# Altium schematic sheet ftdi.SchDoc
size A4
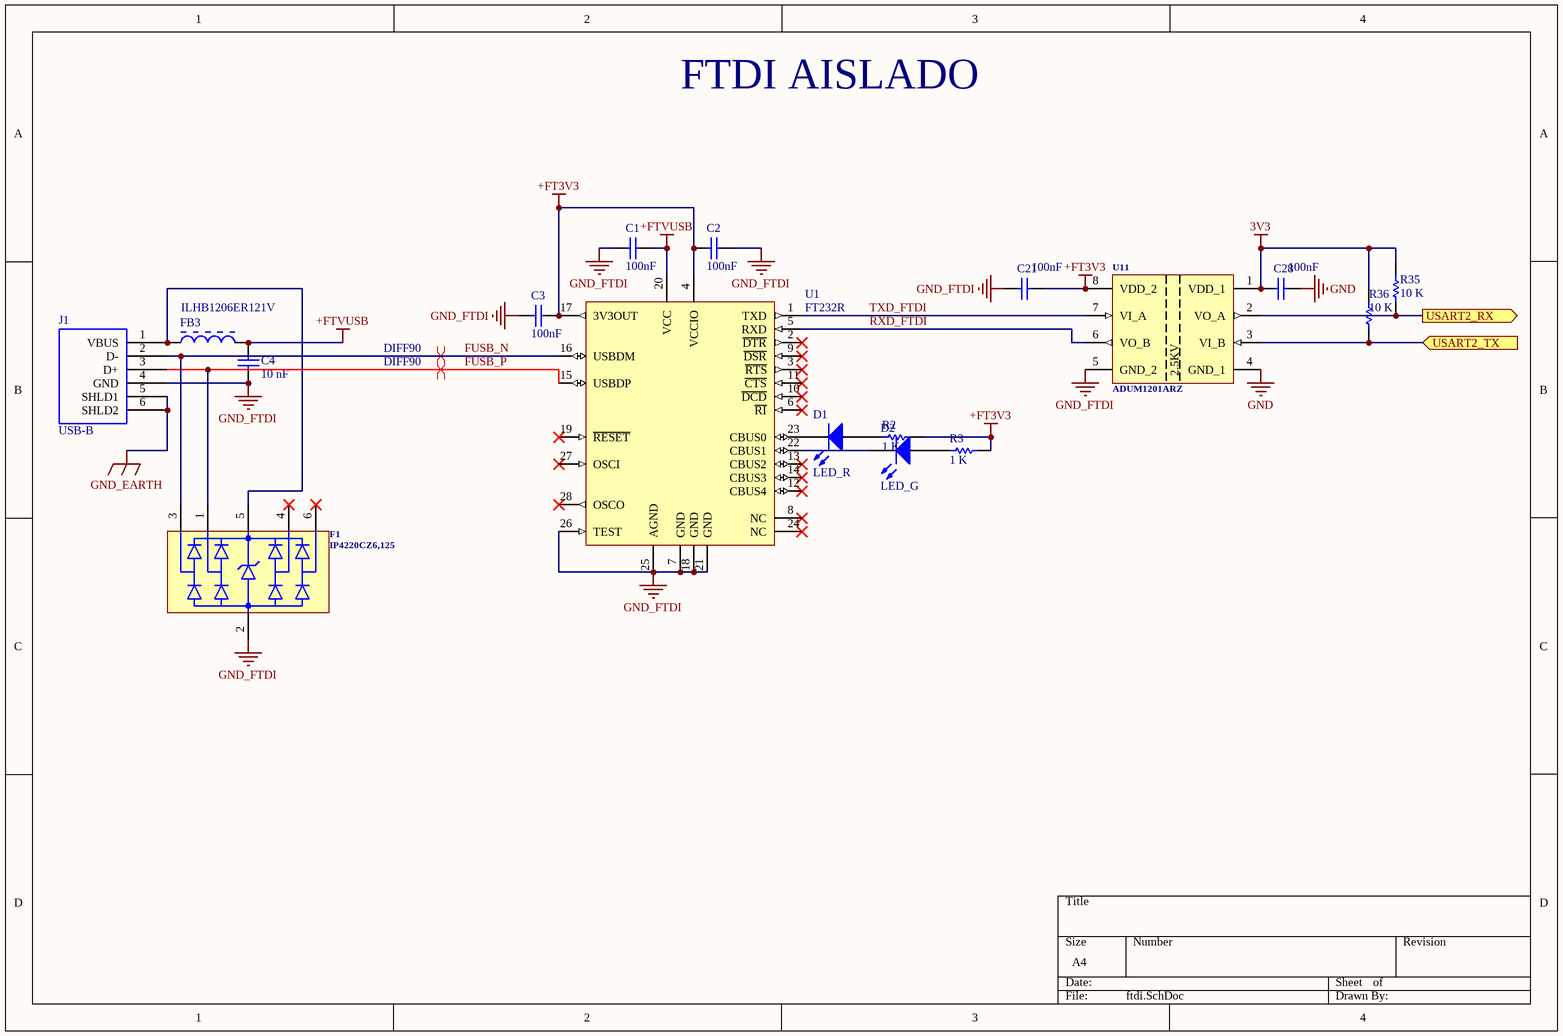
[diagram p0: ftdi.SchDoc]

## Parts
C1  100nF  [0603]
C2  100nF  [0603]
C3  100nF  [0603]
C4  10 nF  [0603]
C21  100nF  [0603]
C28  100nF  [0603]
D1  LED_R  [LED0603R]
D2  LED_G  [LED0603G]
F1  IP4220CZ6,125  [SOT26A-6N]
FB3  ILHB1206ER121V  [1206]
J1  USB-B  [USB-B_292304-1]
R2  1 K  [R0603]
R3  1 K  [R0603]
R35  10 K  [R0603]
R36  10 K  [R0603]
U1  FT232R  [FT232RL_SSOP-28_L]
U11  ADUM1201ARZ  [SOIC127P600-8AN]

## Ports
USART2_RX (out), USART2_TX (in)

## Nets
3V3: C28.1 R35.2 R36.2 U11.1(VDD_1)
+FT3V3: C2.1 C3.2 C21.2 R2.2 R3.2 U1.4(VCCIO) U1.17(3V3OUT) U11.8(VDD_2)
+FTVUSB: C1.2 C4.2 FB3.2 U1.20(VCC)
GND: C28.2 U11.4(GND_1)
GND_EARTH: J1.5(SHLD1) J1.6(SHLD2)
GND_FTDI: C1.1 C2.2 C3.1 C4.1 C21.1 F1.2 J1.4(GND) U1.7(GND) U1.18(GND) U1.21(GND) U1.25(AGND) U1.26(TEST) U11.5(GND_2)
FUSB_N: F1.3 J1.2(D-) U1.16(USBDM)
FUSB_P: F1.1 J1.3(D+) U1.15(USBDP)
RXD_FTDI: U1.5(RXD) U11.6(VO_B)
TXD_FTDI: U1.1(TXD) U11.7(VI_A)
USART2_RX: R35.1 U11.2(VO_A) ; port USART2_RX
USART2_TX: R36.1 U11.3(VI_B) ; port USART2_TX
NetD1_1: D1.1(A) R2.1
NetD1_2: D1.2(K) U1.23(CBUS0)
NetD2_1: D2.1(A) R3.1
NetD2_2: D2.2(K) U1.22(CBUS1)
NetF1_5: F1.5 FB3.1 J1.1(VBUS)

Not connected (* = marked no-connect by the designer): F1 4* 6*; U1 2(~{DTR})* 3(~{RTS})* 6(~{RI})* 8(NC)* 9(~{DSR})* 10(~{DCD})* 11(~{CTS})* 12(CBUS4)* 13(CBUS2)* 14(CBUS3)* 19(~{RESET})* 24(NC)* 27(OSCI)* 28(OSCO)*

## Layout directives
differential pair; net class DIFF90: FUSB_N, FUSB_P

## Notes on the sheet
- FTDI AISLADO
- (in symbol ADUM1201ARZ) 2.5KV

## Library data of the parts
C1-C3 C21 C28 = 6003071: Capacitor; Value: 100pF; DescripcionArticulo: COND. CERAMICO SMD 0603 100 NF X7R 50V 10%; tipo: condensador; Published: 8-Jun-2000; LatestRevisionDate: 17-Jul-2002; LatestRevisionNote: Re-released for DXP Platform.; PackageReference: RAD-0.3; Publisher: Altium Limited; PackageDescription: Radial Cap, Thru-Hole; 2 Leads; 0.3 in Pin Spacing; Codigo: 6003071; valor: 100nF
C4 = 6003067: Capacitor; Value: 100pF; DescripcionArticulo: COND. CERAMICO SMD 0603 10 NF X7R 50V 10%; tipo: condensador; Published: 8-Jun-2000; LatestRevisionDate: 17-Jul-2002; LatestRevisionNote: Re-released for DXP Platform.; PackageReference: RAD-0.3; Publisher: Altium Limited; PackageDescription: Radial Cap, Thru-Hole; 2 Leads; 0.3 in Pin Spacing; Codigo: 6003067; valor: 10 nF
D1 = 6006048: Typical RED, GREEN, YELLOW, AMBER GaAs LED; DescripcionArticulo: DIODO LED ROJO 0603 APT1608SR 650 nm; Descripcion2Articulo: APT1608SR Kingbright; Escandallo: Sí; tipo: diodo; Published: 8-Jun-2000; LatestRevisionDate: 17-Jul-2002; LatestRevisionNote: Re-released for DXP Platform.; PackageVersion: Feb-2002; PackageReference: 3.2X1.6X1.1; Publisher: Altium Limited; PackageDescription: SM LED; 2 Flat Leads; Codigo: 6006048; valor: LED_R
D2 = 6006022: Typical RED, GREEN, YELLOW, AMBER GaAs LED; DescripcionArticulo: DIODO LED VERDE SML-LX0603GW 1.6X0.8X0.6; Escandallo: Sí; tipo: diodo; Published: 8-Jun-2000; LatestRevisionDate: 17-Jul-2002; LatestRevisionNote: Re-released for DXP Platform.; PackageVersion: Feb-2002; PackageReference: 3.2X1.6X1.1; Publisher: Altium Limited; PackageDescription: SM LED; 2 Flat Leads; Codigo: 6006022; valor: LED_G
F1 = IP4220CZ6,125: USB DUAL ESD PROTECT 6TSOP; Fabricante: NXP; rs_ref: 510-291; Montaje: -; Value: USB DUAL ESD PROTECT 6TSOP; Referencia: IP4220CZ6,125
FB3 = 4039004: Chip Ferrite Bead for Power Lines, 33 Ohm, 6000 mA, , -55 to 125 degC, 3.2 x 1.6 x 1.3 mm SMD, Tape and Reel; DescripcionArticulo: FERRITA ILHB1206ER121V 6A-0.02; Escandallo: Sí; Codigo: 4039004; valor: ILHB1206ER121V; tipo: ferrita
J1 = 5110015: DescripcionArticulo: CONECTOR RECEPTACLE, USB, R/A, TYPE B; Descripcion2Articulo: TYCO ELECTRONICS - 292304-1; Escandallo: Sí; tipo: conector; Codigo: 5110015; valor: USB-B
R2 R3 = 6005111: Resistor; Value: 1K; DescripcionArticulo: RESISTENCIA SMD 0603 1 K, 1% 0.1W; tipo: resistencia; Published: 8-Jun-2000; LatestRevisionDate: 17-Jul-2002; LatestRevisionNote: Re-released for DXP Platform.; PackageReference: AXIAL-0.3; Publisher: Altium Limited; PackageDescription: Axial Device, Thru-Hole; 2 Leads; 0.3 in Pin Spacing; Codigo: 6005111; valor: 1 K
R35 R36 = 6005102: Resistor; Value: 1K; DescripcionArticulo: RESISTENCIA SMD 0603 10 K, 1%; tipo: resistencia; Published: 8-Jun-2000; LatestRevisionDate: 17-Jul-2002; LatestRevisionNote: Re-released for DXP Platform.; PackageReference: AXIAL-0.3; Publisher: Altium Limited; PackageDescription: Axial Device, Thru-Hole; 2 Leads; 0.3 in Pin Spacing; Codigo: 6005102; valor: 10 K
U1 = 6001143: USB UART Asynchronous Serial Data Transfer Chip, 28-pin SSOP, Tape and Reel; PartNumber: FT232RL-Reel; Manufacturer: FTDI; DescripcionArticulo: IC ROHS SMD USB TO UART FT232RL, SSOP28; Escandallo: Sí; PackageVersion: Mar-12; PackageReference: SSOP-28; ComponentLink2Description: Datasheet; DatasheetVersion: ver 2.10, Mar-2012; PackageDescription: 28-Pin Small Outline Package 0.65 mm Pitch; ComponentLink1Description: Manufacturer URL; RevisionNote: DatasheetVersion updated to 2.10 Mar-2012; ComponentLink1URL: http://www.ftdichip.com/; ComponentLink2URL: http://www.ftdichip.com/Support/Documents/DataSheets/ICs/DS_FT232R.pdf; Codigo: 6001143; valor: FT232R
U11 = ADUM1201ARZ: ISOLAT DGTL 2.5KVrms 1Mbps 2CH 8-SOIC; Fabricante: Analog; Value: CAN/RS_232/RS_485 ISOLATOR; rs_ref: 496-7519; Referencia: ADUM1201ARZ; Montaje: -